# Altium project ETR_CELLMETER_MASTER.PrjPcb (part 3 of 3)

## Sheet eFuse_Slave_Supply.SchDoc
size A4
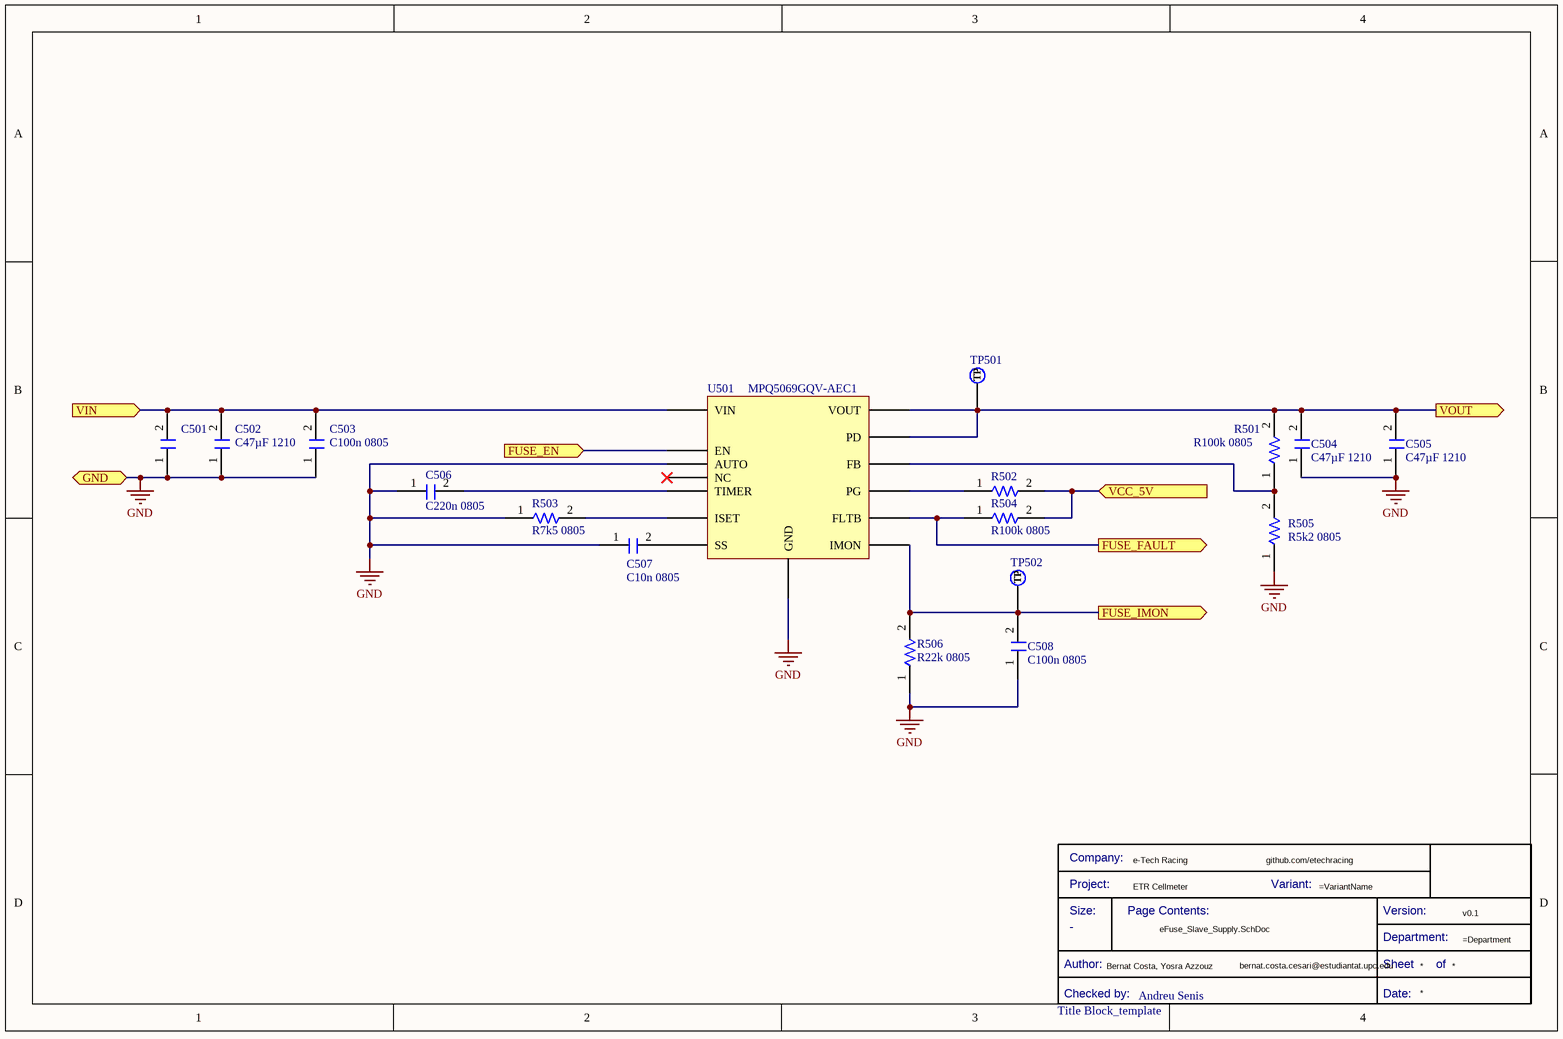
[diagram p5: eFuse_Slave_Supply.SchDoc]

### Parts
(Parts that share a designator on the sheet are numbered #1, #2 ... from top to bottom, then left to right.)
*#5  Title Block_template  Checked by:: Andreu Senis  (graphical)
C501  C47µF-10V-1210  [FP-GRM32E-0_3-0_2-IPC_C]  (value not drawn)
C502  C47µF 1210  [FP-GRM32E-0_3-0_2-IPC_C]
C503  C100n 0805  [C0805FNPC-R]
C504  C47µF 1210  [FP-GRM32E-0_3-0_2-IPC_C]
C505  C47µF 1210  [FP-GRM32E-0_3-0_2-IPC_C]
C506  C220n 0805  [C0805FNPC-W]
C507  C10n 0805  [C0805FNPC-R]
C508  C100n 0805  [C0805FNPC-R]
R501  R100k 0805  [RESC2013X70X40NL20T20]
R502  R100k 0805  [RESC2013X70X40NL20T20]  (value not drawn)
R503  R7k5 0805  [RESC2013X50X30ML20T20]
R504  R100k 0805  [RESC2013X70X40NL20T20]
R505  R5k2 0805  [RESC2013X70X40NL20T20]
R506  R22k 0805  [RESC2013X70X40NL20T20]
TP501  TestPoint  [TestPoint]  (value not drawn)  (no BOM)
TP502  TestPoint  [TestPoint]  (value not drawn)  (no BOM)
U501  MPQ5069GQV-AEC1  [QFN127P600-8N]

### Ports
FUSE_EN (in), FUSE_FAULT (out), FUSE_IMON (out), GND (bidir), VCC_5V (in), VIN (in), VOUT (out)

### Nets
+5: R502.2 R504.2 ; port VCC_5V
+12F: C504.2 C505.2 R501.2 TP501.1(TP) U501.13(PD) U501.14(VOUT) ; port VOUT
+12S: C501.2 C502.2 C503.2 U501.1(VIN) ; port VIN
GND: C501.1 C502.1 C503.1 C504.1 C505.1 C506.1 C507.1 C508.1 R503.1 R505.1 R506.1 U501.3(AUTO) U501.8(GND) ; port GND
F_EN: U501.2(EN) ; port FUSE_EN
F_FAULT: R504.1 U501.10(FLTB) ; port FUSE_FAULT
F_IMON: C508.2 R506.2 TP502.1(TP) U501.9(IMON) ; port FUSE_IMON
NetC506_2: C506.2 U501.5(TIMER)
NetC507_2: C507.2 U501.7(SS)
NetR501_1: R501.1 R505.2 U501.12(FB)
NetR502_1: R502.1 U501.11(PG)
NetR503_2: R503.2 U501.6(ISET)

Not connected (* = marked no-connect by the designer): U501 4(NC)*

### Notes on the sheet
- (in symbol CMP-00043-2) Company:; Project:; Variant:; Size:; Page Contents:; Version:; Department:; Author:; Sheet; of; Checked by:; Date:

### Library data of the parts
*#5 = CMP-00043-2: Standard Title Block; .Creator: GP; Size: -; Design Item ID: Title Block_template; Category: Title Block; .PCBcheck: GP; Source: e-Tech_Racing.SchLib; .SCHcheck: GP
C501 C502 C504 C505 = CMP-001-00003-2: Ceramic Capacitor, Multilayer, Ceramic, 10V, 10% +Tol, 10% -Tol, X6S, 22% TC, 47uF, Surface Mount, 1210; Value: 47µF; Case/Package: 1210; RoHS Compliant: Yes; Min Operating Temperature: -55°C; Capacitor Type: Ceramic; Max Operating Temperature: 105°C; Mounting Technology: Surface Mount; Pins: 2
C503 C508 = CMP-00063-1: Cap, 0.1ΜF, 50V, 10%, X7R, 0805; Manufacturer 1: Wurth Electronics; Manufacturer Part Number 1: 885012207098; Value: 100nF; .Creator: DR; Pricing 1: 100=0,10200, 500=0,07100, 2000=0,06100 (GBP); ComponentLink1URL: http://www.farnell.com/datasheets/1958498.pdf?src-supplier=Farnell; Design Item ID: C100n-50V-0805FNPC-X7R; Voltage Rating (DC): 50V; Voltage Rating: 50V; Max Operating Temperature: 125°C; RoHS: Yes; Case Code (Metric): 2012; Mount: Surface Mount; REACH SVHC: Unknown; Stock 1: 8000; Source: Passives.SchLib; Tolerance: 10%; RoHS Compliant: Yes; Dielectric: X7R; ComponentLink2Description: http://www.farnell.com/datasheets/1958498.pdf?src-supplier=Element14; ComponentLink2URL: http://www.farnell.com/datasheets/1958498.pdf?src-supplier=Element14; Min Operating Temperature: -55°C; Width: 0.049inch; Category: Ceramic Capacitors; Thickness: 0.035inch; Length: 0.079inch; ComponentLink3URL: https://katalog.we-online.de/pbs/datasheet/885012207098.pdf?src-supplier=Digi-Key; Case/Package: 0805; ComponentLink3Description: https://katalog.we-online.de/pbs/datasheet/885012207098.pdf?src-supplier=Digi-Key; Packaging: Cut Tape; ComponentLink1Description: http://www.farnell.com/datasheets/1958498.pdf?src-supplier=Farnell; ComponentLink4Description: http://www.farnell.com/datasheets/1958498.pdf?src-supplier=Newark; ComponentLink4URL: http://www.farnell.com/datasheets/1958498.pdf?src-supplier=Newark
C506 = CMP-00048-1: Cap Ceramic 0.22uF 50V X5R 10% Pad SMD 0805 85C Low ESR Automotive T/R; Manufacturer: Taiyo Yuden; Manufacturer Part Number: UMK212BJ224KGHT; .Creator: DR; Value: 220nF; ComponentLink2URL: https://eu.mouser.com/ProductDetail/Taiyo-Yuden/UMK212BJ224KGHT?qs=CNQs48zzdnpf%2FbZJTfp33Q%3D%3D; Design Item ID: C0.22u-0805FNPC-X5R; RoHS Compliant: Yes; Min Operating Temperature: -55°C; ComponentLink2Description: Where buy it; Thickness: 0.053inch; Tolerance: 10%; Termination: SMD/SMT; Stock 1: 900; Length: 0.079inch; RoHS: Yes; Voltage Rating (DC): 50V; Lead Free: Lead Free; Source: Passives.SchLib; Mount: Surface Mount; Halogen Free: Halogen Free; Width: 0.049inch; Ratings: AEC-Q200; Case/Package: 0805; ComponentLink1Description: Datasheet; Dielectric: X5R; Max Operating Temperature: 85°C; Package Quantity: 3000; Case Code (Metric): 2012; ComponentLink1URL: https://eu.mouser.com/datasheet/2/396/taiyo_yuden_12132018_mlcc11_hq_e-1510082.pdf; Voltage Rating: 50V; Pricing 1: 1=0,20000, 10=0,13700, 50=0,08220, 100=0,06950, 500=0,04754, 1000=0,04206 (USD); Category: Capacitor; Packaging: Tape and Reel; Height: 1.25mm
C507 = CMP-00053-1: Cap, 0.01ΜF, 50V, 10%, X7R, 0805; Manufacturer Part Number 1: 885012207092; Manufacturer 1: Wurth Electronics; .Creator: DR; Value: 10nF; ComponentLink4URL: https://katalog.we-online.de/pbs/datasheet/885012207092.pdf?src-supplier=Digi-Key; Width: 0.049inch; ComponentLink1URL: http://www.farnell.com/datasheets/1958497.pdf?src-supplier=Farnell; Max Operating Temperature: 125°C; Packaging: Cut Tape; Mount: Surface Mount; ComponentLink2Description: http://www.farnell.com/datasheets/1958497.pdf?src-supplier=Element14; Voltage Rating: 50V; Source: Passives.SchLib; Design Item ID: C10n-50V-0805FNPC-X7R; ComponentLink4Description: https://katalog.we-online.de/pbs/datasheet/885012207092.pdf?src-supplier=Digi-Key; Stock 1: 1; Tolerance: 10%; REACH SVHC: Unknown; ComponentLink2URL: http://www.farnell.com/datasheets/1958497.pdf?src-supplier=Element14; ComponentLink1Description: http://www.farnell.com/datasheets/1958497.pdf?src-supplier=Farnell; RoHS: Yes; Min Operating Temperature: -55°C; Voltage Rating (DC): 50V; Dielectric: X7R; ComponentLink3URL: http://www.farnell.com/datasheets/1958497.pdf?src-supplier=Newark; Category: Ceramic Capacitors; ComponentLink3Description: http://www.farnell.com/datasheets/1958497.pdf?src-supplier=Newark; Case/Package: 0805; Pricing 1: 4000=0,03200, 12000=0,03100 (USD); Length: 0.079inch; RoHS Compliant: Yes; Case Code (Metric): 2012; Thickness: 0.035inch
R501 R502 R504-R506 = CMP-009-00003-2: Fixed Resistor, Metal Glaze/thick Film, 0.125W, 100000ohm, 150V, 5% +/-Tol, 200ppm/Cel, Surface Mount, 0805; Value: 100k; Power: 125mW; Max Operating Temperature: 155°C; Mounting Technology: Surface Mount; RoHS Compliant: Yes; Min Operating Temperature: -55°C; Pins: 2; Case/Package: 0805; Tolerance: 5%
R503 = CMP-009-00005-1: Fixed Resistor, Metal Glaze/thick Film, 0.125W, 15000ohm, 150V, 1% +/-Tol, 100ppm/Cel, Surface Mount, 0805; Value: 15k; Power: 125mW; Min Operating Temperature: -55°C; Mounting Technology: Surface Mount; RoHS Compliant: No; Tolerance: 1%; Pins: 2; Max Operating Temperature: 155°C; Case/Package: 0805
TP501 TP502 = CMP-00042-1: Test Point 1x1 mm; .SCHcheck: GP; Category: TestPoint; Source: e-Tech_Racing.SchLib; .Creator: GP; .PCBcheck: GP; Design Item ID: TestPoint
U501 = CMP-019-00005-1: 7mΩ Protection Switch with Current Monitor for Automotive Battery Systems AEC-Q100 Qualified; pin to pad: 1>21+22+23+24+25 2>1 3>2 4>3 5>4 6>5 7>6 8>7 9>8 10>9 11>10 12>11 13>12 14>13+14+15+16+17+18+19+20

## Sheet CAN.SchDoc
size A4
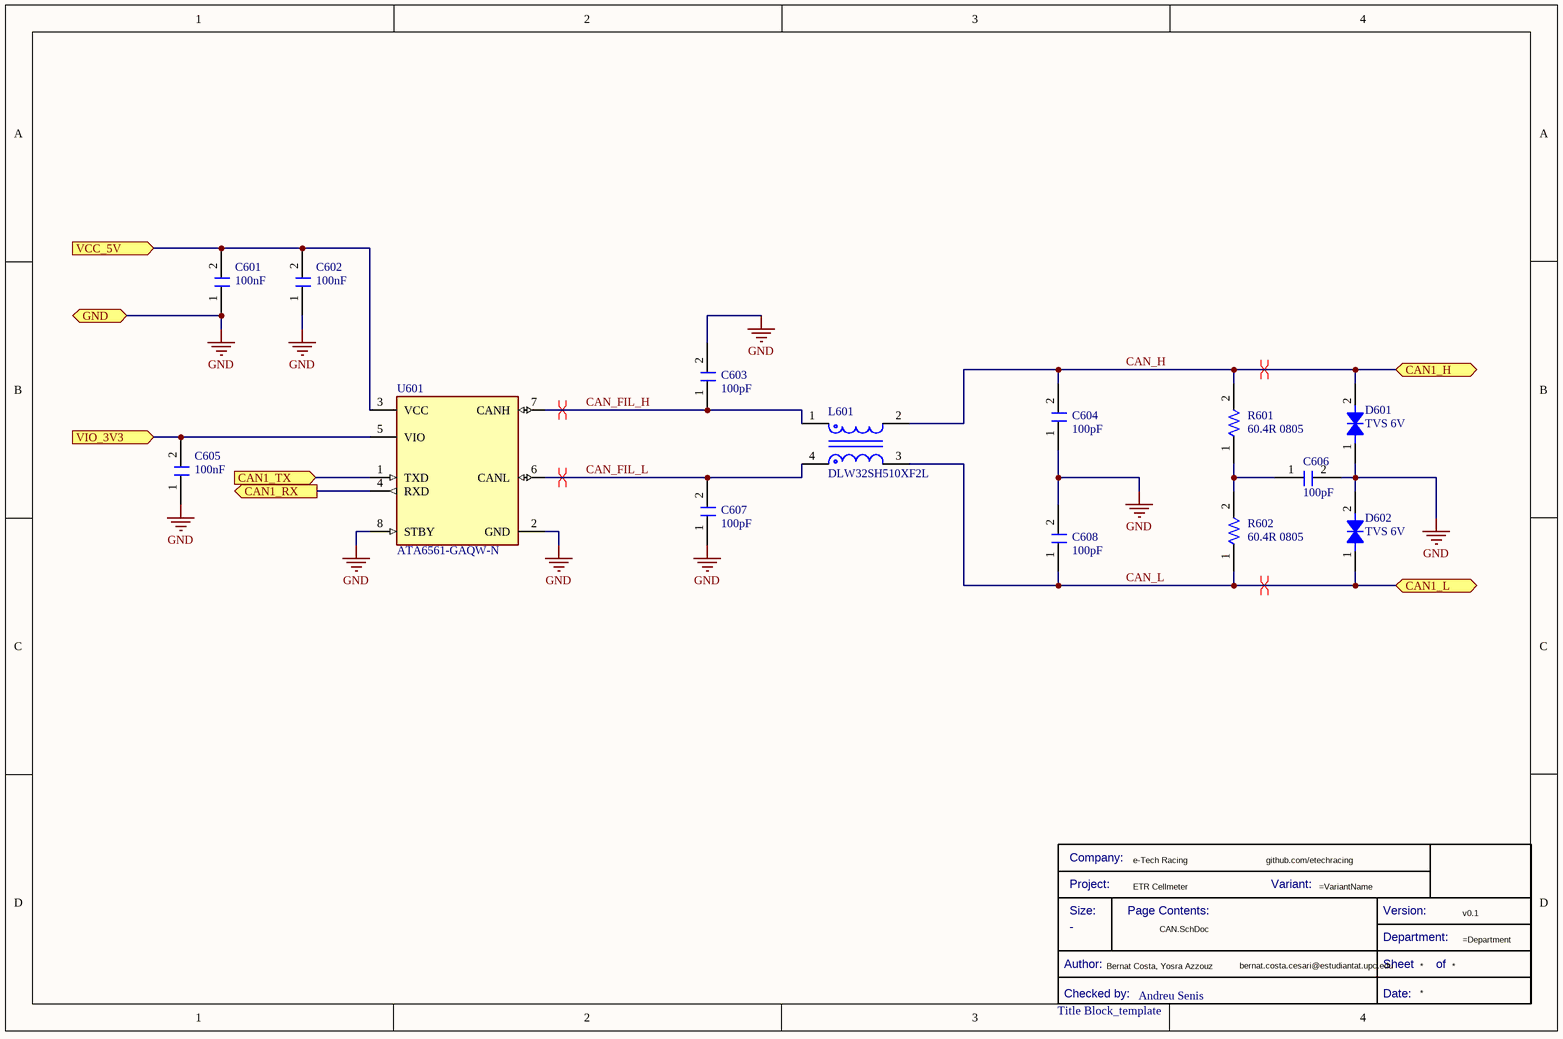
[diagram p6: CAN.SchDoc]

### Parts
(Parts that share a designator on the sheet are numbered #1, #2 ... from top to bottom, then left to right.)
*#6  Title Block_template  Checked by:: Andreu Senis  (graphical)
C601  value 100nF  [C0805FNPC-R]  (hidden comment: C100n-50V-0805FNPC-X7R)
C602  value 100nF  [C0805FNPC-R]  (hidden comment: C100n-50V-0805FNPC-X7R)
C603  value 100pF  [C0805FNPC-W]  (hidden comment: C100p-50V-0805FNPC-C0G/NP0)
C604  value 100pF  [C0805FNPC-W]  (hidden comment: C100p-50V-0805FNPC-C0G/NP0)
C605  value 100nF  [C0805FNPC-R]  (hidden comment: C100n-50V-0805FNPC-X7R)
C606  value 100pF  [C0805FNPC-W]  (hidden comment: C100p-50V-0805FNPC-C0G/NP0)
C607  value 100pF  [C0805FNPC-W]  (hidden comment: C100p-50V-0805FNPC-C0G/NP0)
C608  value 100pF  [C0805FNPC-W]  (hidden comment: C100p-50V-0805FNPC-C0G/NP0)
D601  TVS 6V  [DTVS-DO-214AC]
D602  TVS 6V  [DTVS-DO-214AC]
L601  DLW32SH510XF2L  [FP-DLW32PH-MFG]
R601  value 60.4R 0805  [R0805FTK]  (hidden comment: R60-0805FTN)
R602  value 60.4R 0805  [R0805FTK]  (hidden comment: R60-0805FTN)
U601  ATA6561-GAQW-N  [FP-C04-057-OA-MFG]

### Ports
CAN1_H (bidir), CAN1_L (bidir), CAN1_RX (out), CAN1_TX (in), GND (bidir), VCC_5V (in), VIO_3V3 (in)

### Nets
+3.3V: C605.2 U601.5(VIO) ; port VIO_3V3
+5: C601.2 C602.2 U601.3(VCC) ; port VCC_5V
GND: C601.1 C602.1 C603.2 C604.1 C605.1 C606.2 C607.1 C608.2 D601.1 D602.2 U601.2(GND) U601.8(STBY) ; port GND
CAN_FIL_H: C603.1 L601.1 U601.7(CANH)
CAN_FIL_L: C607.2 L601.4 U601.6(CANL)
CAN_H: C604.2 D601.2 L601.2 R601.2 ; port CAN1_H  [project net CAN1_H]
CAN_L: C608.1 D602.1 L601.3 R602.1 ; port CAN1_L  [project net CAN1_L]
NetC606_1: C606.1 R601.1 R602.2
NetU201_70: U601.1(TXD) ; port CAN1_TX
NetU201_71: U601.4(RXD) ; port CAN1_RX

### Layout directives
differential pair: CAN1_H, CAN1_L, CAN_FIL_H, CAN_FIL_L

### Notes on the sheet
- (in symbol CMP-00043-2) Company:; Project:; Variant:; Size:; Page Contents:; Version:; Department:; Author:; Sheet; of; Checked by:; Date:

### Library data of the parts
*#6 = CMP-00043-2: Standard Title Block; .Creator: GP; Size: -; Design Item ID: Title Block_template; Category: Title Block; .PCBcheck: GP; Source: e-Tech_Racing.SchLib; .SCHcheck: GP
C601 C602 C605 = CMP-00063-1: Cap, 0.1ΜF, 50V, 10%, X7R, 0805; Manufacturer 1: Wurth Electronics; Manufacturer Part Number 1: 885012207098; .Creator: DR; Pricing 1: 100=0,10200, 500=0,07100, 2000=0,06100 (GBP); ComponentLink1URL: http://www.farnell.com/datasheets/1958498.pdf?src-supplier=Farnell; Design Item ID: C100n-50V-0805FNPC-X7R; Voltage Rating (DC): 50V; Voltage Rating: 50V; Max Operating Temperature: 125°C; RoHS: Yes; Case Code (Metric): 2012; Mount: Surface Mount; REACH SVHC: Unknown; Stock 1: 8000; Source: Passives.SchLib; Tolerance: 10%; RoHS Compliant: Yes; Dielectric: X7R; ComponentLink2Description: http://www.farnell.com/datasheets/1958498.pdf?src-supplier=Element14; ComponentLink2URL: http://www.farnell.com/datasheets/1958498.pdf?src-supplier=Element14; Min Operating Temperature: -55°C; Width: 0.049inch; Category: Ceramic Capacitors; Thickness: 0.035inch; Length: 0.079inch; ComponentLink3URL: https://katalog.we-online.de/pbs/datasheet/885012207098.pdf?src-supplier=Digi-Key; Case/Package: 0805; ComponentLink3Description: https://katalog.we-online.de/pbs/datasheet/885012207098.pdf?src-supplier=Digi-Key; Packaging: Cut Tape; ComponentLink1Description: http://www.farnell.com/datasheets/1958498.pdf?src-supplier=Farnell; ComponentLink4Description: http://www.farnell.com/datasheets/1958498.pdf?src-supplier=Newark; ComponentLink4URL: http://www.farnell.com/datasheets/1958498.pdf?src-supplier=Newark
C603 C604 C606-C608 = CMP-00068-1: Multilayer Ceramic Capacitor, Wcap-Csgp Series, 100 Pf, 5%, C0G / Np0, 50 V, 0805 [2012 Metric] Rohs Compliant: Yes; Manufacturer Part Number: 885012007057; Manufacturer: Wurth Electronics; Voltage Rating (DC): 50V; .Creator: DR; Pricing 1: 4000=0,03900, 12000=0,03800 (USD); Case/Package: 0805; Packaging: Cut Tape; ComponentLink3URL: http://www.farnell.com/datasheets/1958443.pdf?src-supplier=Element14; Dielectric: C0G; Design Item ID: C100p-50V-0805FNPC-C0G/NP0; ComponentLink2URL: https://katalog.we-online.de/pbs/datasheet/885012007057.pdf?src-supplier=Digi-Key; Length: 0.079inch; Case Code (Metric): 2012; Stock 1: 1; ComponentLink1URL: http://www.farnell.com/datasheets/1958443.pdf?src-supplier=Farnell; Category: Ceramic Capacitors; ComponentLink5URL: https://www.we-online.com/catalog/en/WCAP-CSGP-50VDC#885012007057; Mount: Surface Mount; Thickness: 0.035inch; ComponentLink4Description: http://www.farnell.com/datasheets/1958443.pdf?src-supplier=Newark; REACH SVHC: Unknown; ComponentLink3Description: http://www.farnell.com/datasheets/1958443.pdf?src-supplier=Element14; Source: Passives.SchLib; ComponentLink1Description: http://www.farnell.com/datasheets/1958443.pdf?src-supplier=Farnell; ComponentLink5Description: Where buy it; RoHS Compliant: Yes; ComponentLink2Description: https://katalog.we-online.de/pbs/datasheet/885012007057.pdf?src-supplier=Digi-Key; Width: 0.049inch; ComponentLink4URL: http://www.farnell.com/datasheets/1958443.pdf?src-supplier=Newark; Voltage Rating: 50V; Min Operating Temperature: -55°C; Max Operating Temperature: 125°C; Tolerance: 5%; RoHS: Yes
D601 D602 = CMP-00154-1: TVS diode [Würth Elektronik] 824501600 TVS diode; Manufacturer: Wurth Electronics; Power Line Protection: No; Forward Voltage: 7.02V; Number of Bidirectional Channels: 1; Peak Pulse Current: 38.8A; .Creator: DO; Polarity: Bidirectional; Peak Pulse Power: 400W; Clamping Voltage: 10.3V; ComponentLink2Description: http://www.farnell.com/datasheets/2036401.pdf?src-supplier=Element14; Source: Filter components.SchLib; ComponentLink3URL: https://katalog.we-online.de/pbs/datasheet/824501600.pdf?src-supplier=Digi-Key; Mount: Surface Mount; Design Item ID: DTVS-6V-DO-214AC; ComponentLink3Description: https://katalog.we-online.de/pbs/datasheet/824501600.pdf?src-supplier=Digi-Key; RoHS: Yes; Resistor Type: Zener; REACH SVHC: Unknown; Pins: 2; Min Breakdown Voltage: 7.02V; Min Operating Temperature: -65°C; ComponentLink1URL: https://www.we-online.com/catalog/en/WE-TVSP?sq=824501600#824501600; Reverse Standoff Voltage: 6V; Stock 1: 780; Pricing 1: 1=0,28000, 10=0,26100, 50=0,26100, 100=0,23400, 500=0,20400, 1000=0,17400, 10000=0,17400 (USD); ComponentLink2URL: http://www.farnell.com/datasheets/2036401.pdf?src-supplier=Element14; Category: TVS Diodes; ComponentLink1Description: Where buy it; Manufacturer Part Number: 824501600; Packaging: Cut Tape; RoHS Compliant: Yes; Max Operating Temperature: 150°C
L601 = CMP-006-00001-1: Cmc 51UH 200MA 2LN SMD AEC-Q200
R601 R602 = CMP-00080-1: Res Thin Film 0805 60.4 Ohm 0.1% 1/8W ±25ppm/°C Molded SMD SMD Punched Carrier T/R; Manufacturer 1: Panasonic; Manufacturer Part Number 1: ERA-6AEB60R4V; Voltage Rating (DC): 100V; Power Rating: 125mW; Voltage Rating: 200V; .Creator: DR; Lead Free: Lead Free; ComponentLink4URL: https://datasheet.ciiva.com/30184/54aoa0000ce26-30184022.pdf?src-supplier=Onlinecomponents.com; Source: Passives.SchLib; Radiation Hardening: No; ComponentLink5Description: https://datasheet.ciiva.com/9188/aoa0000ce26-9188476.pdf?src-supplier=Avnet; Depth: 1.25mm; Length: 2mm; ComponentLink3Description: https://datasheet.ciiva.com/5951/485442-5951173.pdf?src-supplier=Farnell; RoHS: Yes; Tolerance: 0.1%; Termination: SMD/SMT; ComponentLink1Description: https://datasheet.ciiva.com/11811/0900766b80eb1d8c-11811180.pdf?src-supplier=RSComponents; Max Power Dissipation: 125mW; Package Quantity: 5000; Mount: Surface Mount; Number of Terminations: 2; Temperature Coefficient: 25ppm/°C; Case/Package: 0805; Packaging: Tape and Reel; Contact Plating: Tin; Category: Chip SMD Resistors; ComponentLink1URL: https://datasheet.ciiva.com/11811/0900766b80eb1d8c-11811180.pdf?src-supplier=RSComponents; Features: Automotive AEC-Q200; Weight: 0.000194oz; Resistor Type: Thin Film,Metal Film; Design Item ID: R60-0805FTN; Stock 1: 5000; Case Code (Metric): 2012; ComponentLink2Description: https://datasheet.ciiva.com/41450/001181146-da-01-en-widerstand-era-0805-60r4-0-1-5000st-41450303.pdf?src-supplier=Conrad; ComponentLink4Description: https://datasheet.ciiva.com/30184/54aoa0000ce26-30184022.pdf?src-supplier=Onlinecomponents.com; ComponentLink3URL: https://datasheet.ciiva.com/5951/485442-5951173.pdf?src-supplier=Farnell; Max Operating Temperature: 155°C; Pricing 1: 1=0,04650, 10=0,03900, 100=0,02860 (USD); ComponentLink2URL: https://datasheet.ciiva.com/41450/001181146-da-01-en-widerstand-era-0805-60r4-0-1-5000st-41450303.pdf?src-supplier=Conrad; ComponentLink5URL: https://datasheet.ciiva.com/9188/aoa0000ce26-9188476.pdf?src-supplier=Avnet; Min Operating Temperature: -55°C; Pins: 2; Width: 1.25mm; Height: 0.5mm
U601 = CMP-015-00000-1: CAN Transceiver, 1-Trnsvr, PDSO8; RoHS Compliant: Yes

## Nets that join several sheets
+3.3V: ETR_CELLMETER_MASTER (J5.1), Master_Supply (5 pins), MCU (13 pins), CAN (C605.2 U601.5)
+5: Master_Supply (8 pins), MCU (R203.2 R204.2), Cooling (R302.2 R305.2), Slave_Supply (5 pins), eFuse_Slave_Supply (R502.2 R504.2), CAN (C601.2 C602.2 U601.3)
+12: ETR_CELLMETER_MASTER (J2.1 J4.1), Master_Supply (12 pins)
+12F: ETR_CELLMETER_MASTER (J6.2 J7.2 J8.2 J9.2), eFuse_Slave_Supply (6 pins)
+12S: Slave_Supply (15 pins), eFuse_Slave_Supply (C501.2 C502.2 C503.2 U501.1)
+24: ETR_CELLMETER_MASTER (J1.2), Master_Supply (8 pins), Slave_Supply (8 pins)
GND: ETR_CELLMETER_MASTER (15 pins), Master_Supply (30 pins), MCU (32 pins), Cooling (6 pins), Slave_Supply (29 pins), eFuse_Slave_Supply (13 pins), CAN (12 pins)
CAN1_H: ETR_CELLMETER_MASTER (J3.1 P1.7), CAN (C604.2 D601.2 L601.2 R601.2)
CAN1_L: ETR_CELLMETER_MASTER (J3.2 P1.2), CAN (C608.1 D602.1 L601.3 R602.1)
F_EN: MCU (U201.56), eFuse_Slave_Supply (U501.2)
F_FAULT: MCU (U201.55), eFuse_Slave_Supply (R504.1 U501.10)
F_IMON: MCU (U201.34), eFuse_Slave_Supply (C508.2 R506.2 TP502.1 U501.9)
M_EN: MCU (U201.64), Slave_Supply (R401.2 U401.1)
M_PG: MCU (U201.65), Slave_Supply (R403.2 U401.4)
NetQ301_G: MCU (U201.47), Cooling (Q301.G)
NetQ302_G: MCU (U201.53), Cooling (Q302.G)
NetR301_1: MCU (U201.46), Cooling (R301.1 R303.2 TP302.1)
NetR304_1: MCU (U201.54), Cooling (R304.1 R306.2 TP304.1)
NetU201_70: MCU (U201.70), CAN (U601.1)
NetU201_71: MCU (U201.71), CAN (U601.4)
NRST: ETR_CELLMETER_MASTER (J5.5), MCU (U201.14)
PWM_FAN1: ETR_CELLMETER_MASTER (J2.2), Cooling (Q301.D R302.1 TP301.1)
PWM_FAN2: ETR_CELLMETER_MASTER (J4.2), Cooling (Q302.D R305.1 TP303.1)
RPM_FAN1: ETR_CELLMETER_MASTER (J2.3), Cooling (D301.2 R301.2)
RPM_FAN2: ETR_CELLMETER_MASTER (J4.3), Cooling (D302.2 R304.2)
S_EN: MCU (U201.67), Slave_Supply (R406.2 U402.1)
S_PG: MCU (U201.68), Slave_Supply (R408.1 U402.4)
SWCLK: ETR_CELLMETER_MASTER (J5.2), MCU (U201.76)
SWDIO: ETR_CELLMETER_MASTER (J5.4), MCU (U201.72)